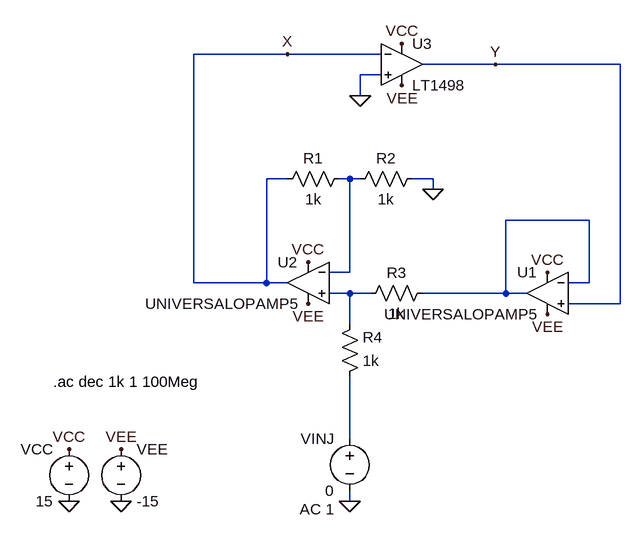
[diagram p0: schematic Loop_Gain_Measurement_Circuit.asc]
Loop_Gain_Measurement_Circuit.asc, the LTspice schematic file:
Version 4.1
SHEET 1 880 680
WIRE 272 -224 128 -224
WIRE 416 -224 272 -224
WIRE 592 -208 480 -208
WIRE 784 -208 592 -208
WIRE 416 -192 384 -192
WIRE 384 -160 384 -192
WIRE 272 -32 240 -32
WIRE 368 -32 352 -32
WIRE 384 -32 368 -32
WIRE 496 -32 464 -32
WIRE 496 -16 496 -32
WIRE 736 32 608 32
WIRE 368 112 368 -32
WIRE 368 112 336 112
WIRE 128 128 128 -224
WIRE 240 128 240 -32
WIRE 240 128 128 128
WIRE 272 128 240 128
WIRE 736 128 736 32
WIRE 736 128 704 128
WIRE 368 144 336 144
WIRE 400 144 368 144
WIRE 608 144 608 32
WIRE 608 144 480 144
WIRE 640 144 608 144
WIRE 784 160 784 -208
WIRE 784 160 704 160
WIRE 368 192 368 144
WIRE 368 368 368 272
WIRE 368 464 368 448
FLAG 672 176 VEE
FLAG 672 112 VCC
FLAG 304 160 VEE
FLAG 304 96 VCC
FLAG 496 -16 0
FLAG 368 464 0
FLAG 448 -176 VEE
FLAG 448 -240 VCC
FLAG 384 -160 0
FLAG 272 -224 X
FLAG 592 -208 Y
FLAG -64 464 0
FLAG -64 384 VCC
FLAG 16 464 0
FLAG 16 384 VEE
SYMBOL OpAmps\\UniversalOpAmp5 672 144 M0
SYMATTR InstName U1
SYMATTR Value2 Avol=1Meg GBW=1G Phimargin=90 SlewPos=100Meg SlewNeg=100Meg
SYMBOL OpAmps\\UniversalOpAmp5 304 128 M0
SYMATTR InstName U2
SYMATTR Value2 Avol=1Meg GBW=1G Phimargin=90 SlewPos=100Meg SlewNeg=100Meg
SYMBOL res 368 -48 R90
WINDOW 0 0 56 VBottom 2
WINDOW 3 32 56 VTop 2
SYMATTR InstName R1
SYMATTR Value 1k
SYMBOL res 480 -48 R90
WINDOW 0 0 56 VBottom 2
WINDOW 3 32 56 VTop 2
SYMATTR InstName R2
SYMATTR Value 1k
SYMBOL res 496 128 R90
WINDOW 0 0 56 VBottom 2
WINDOW 3 32 56 VTop 2
SYMATTR InstName R3
SYMATTR Value 1k
SYMBOL res 352 288 M180
WINDOW 0 36 76 Left 2
WINDOW 3 36 40 Left 2
SYMATTR InstName R4
SYMATTR Value 1k
SYMBOL voltage 368 352 M0
WINDOW 123 24 124 Left 2
WINDOW 39 0 0 Left 0
SYMATTR InstName VINJ
SYMATTR Value 0
SYMATTR Value2 AC 1
SYMBOL OpAmps\\LT1498 448 -272 R0
SYMATTR InstName U3
SYMBOL voltage -64 368 M0
WINDOW 39 0 0 Left 0
SYMATTR InstName VCC
SYMATTR Value 15
SYMATTR Value2 AC 0
SYMBOL voltage 16 368 R0
WINDOW 39 0 0 Left 0
SYMATTR InstName VEE
SYMATTR Value -15
SYMATTR Value2 AC 0
TEXT -88 280 Left 2 !.ac dec 1k 1 100Meg

The netlist it stands for:
* Loop_Gain_Measurement_Circuit.asc
X§U1 Y N002 VCC VEE N002 Avol=1Meg GBW=1G Phimargin=90 SlewPos=100Meg SlewNeg=100Meg  ; UNIVERSALOPAMP5, pins In+ In- V+ V- OUT
X§U2 N003 N001 VCC VEE X Avol=1Meg GBW=1G Phimargin=90 SlewPos=100Meg SlewNeg=100Meg  ; UNIVERSALOPAMP5, pins In+ In- V+ V- OUT
R1 N001 X 1k
R2 0 N001 1k
R3 N002 N003 1k
R4 N004 N003 1k
VINJ N004 0 0 AC 1
X§U3 0 X VCC VEE Y LT1498  ; pins In+ In- V+ V- OUT
VCC VCC 0 15 AC 0
VEE VEE 0 -15 AC 0
.ac dec 1k 1 100Meg
.lib LTC.lib
.backanno
.end